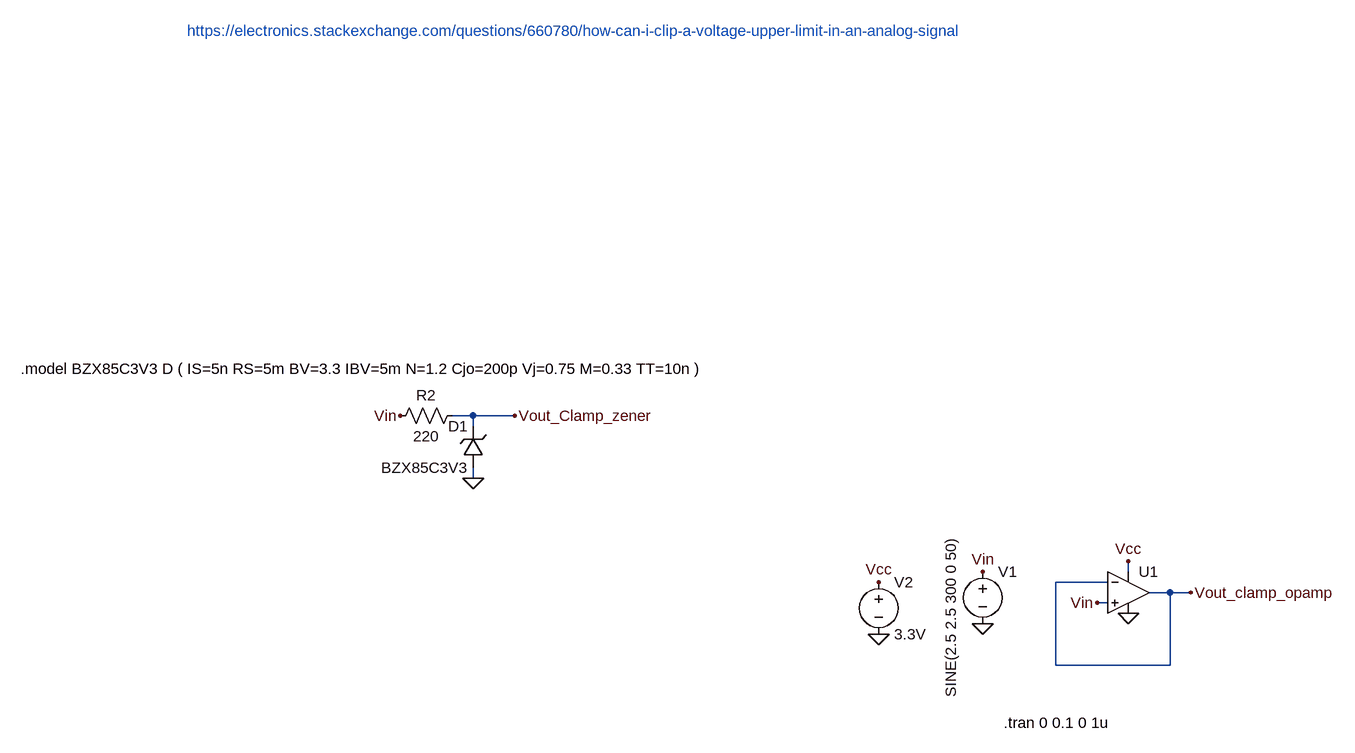
[diagram p0: schematic Voltage clamping.asc]
Voltage clamping.asc, the LTspice schematic file:
Version 4
SHEET 1 1752 720
WIRE 272 112 240 112
WIRE 336 112 272 112
WIRE 272 128 272 112
WIRE 272 208 272 192
WIRE 1280 352 1280 336
WIRE 1248 368 1168 368
WIRE 1344 384 1312 384
WIRE 1376 384 1344 384
WIRE 1248 400 1232 400
WIRE 1168 496 1168 368
WIRE 1344 496 1344 384
WIRE 1344 496 1168 496
FLAG 1056 352 Vin
FLAG 1056 432 0
FLAG 272 208 0
FLAG 160 112 Vin
FLAG 1280 416 0
FLAG 896 448 0
FLAG 1232 400 Vin
FLAG 896 368 Vcc
FLAG 1280 336 Vcc
FLAG 336 112 Vout_Clamp_zener
FLAG 1376 384 Vout_clamp_opamp
SYMBOL zener 288 192 R180
WINDOW 0 24 64 Left 2
WINDOW 3 24 0 Left 2
SYMATTR InstName D1
SYMATTR Value BZX85C3V3
SYMATTR Description Diode
SYMATTR Type diode
SYMBOL voltage 1056 336 R0
WINDOW 3 -49 -38 VRight 2
WINDOW 123 0 0 Left 0
WINDOW 39 0 0 Left 0
SYMATTR Value SINE(2.5 2.5 300 0 50)
SYMATTR InstName V1
SYMBOL res 256 96 R90
WINDOW 0 0 56 VBottom 2
WINDOW 3 32 56 VTop 2
SYMATTR InstName R2
SYMATTR Value 220
SYMBOL voltage 896 352 R0
WINDOW 123 0 0 Left 0
WINDOW 39 0 0 Left 0
SYMATTR InstName V2
SYMATTR Value 3.3V
SYMBOL OpAmps\\UniversalOpAmp2 1280 384 R0
SYMATTR InstName U1
TEXT 1088 584 Left 2 !.tran 0 0.1 0 1u
TEXT -168 -480 Left 2 ;https://electronics.stackexchange.com/questions/660780/how-can-i-clip-a-voltage-upper-limit-in-an-analog-signal
TEXT -424 40 Left 2 !.model BZX85C3V3 D ( IS=5n RS=5m BV=3.3 IBV=5m N=1.2 Cjo=200p Vj=0.75 M=0.33 TT=10n )

The netlist it stands for:
* Voltage clamping.asc
D1 0 Vout_Clamp_zener BZX85C3V3
V1 Vin 0 SINE(2.5 2.5 300 0 50)
R2 Vout_Clamp_zener Vin 220
V2 Vcc 0 3.3V
XU1 Vin Vout_clamp_opamp Vcc 0 Vout_clamp_opamp level2 Avol=1Meg GBW=10Meg Slew=10Meg Ilimit=25m Rail=0 Vos=0 En=0 Enk=0 In=0 Ink=0 Rin=500Meg  ; pins In+ In- V+ V- OUT
.model D D
.lib standard.dio
.tran 0 0.1 0 1u
* https://electronics.stackexchange.com/questions/660780/how-can-i-clip-a-voltage-upper-limit-in-an-analog-signal
.model BZX85C3V3 D ( IS=5n RS=5m BV=3.3 IBV=5m N=1.2 Cjo=200p Vj=0.75 M=0.33 TT=10n )
.lib UniversalOpAmp2.lib
.backanno
.end

* Results of the author's LTspice run, read from the files saved beside the schematic
* Operating Point, zero values left out:
*   V(vout_clamp_zener) = 2.5 V
*   V(vin) = 2.5 V
*   V(vcc) = 3.3 V
*   V(vout_clamp_opamp) = 2.5 V
*   I(D1) = -5.003 nA
*   I(R2) = -5.003 nA
*   I(V1) = -6.703 nA
*   I(V2) = -141.4 µA
*   Ix(u1:1) = 1.7 nA
*   Ix(u1:2) = 1.7 nA
*   Ix(u1:3) = 141.4 µA
*   Ix(u1:4) = -141.4 µA
*   Ix(u1:5) = -1.7 nA
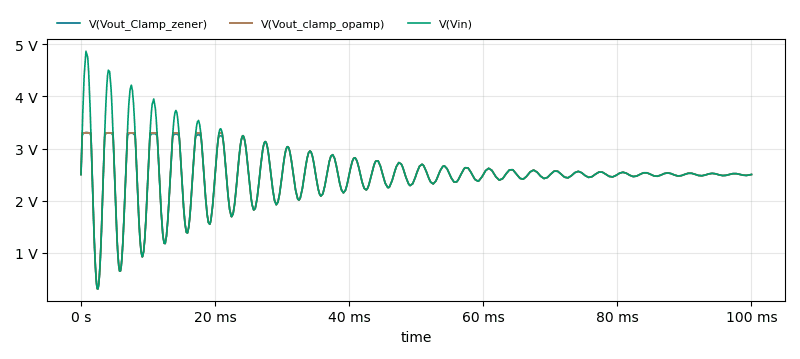
[diagram p1: Transient Analysis of Voltage clamping.asc, plotted from the saved traces]
* Transient Analysis, 1 run:
*   V(Vout_Clamp_zener): min 302.3 mV, max 3.309 V, average 2.473 V, rms 2.516 V, last 2.5 V
*   V(Vout_clamp_opamp): min 302.3 mV, max 3.3 V, average 2.475 V, rms 2.518 V, last 2.5 V
*   V(Vin): min 302.3 mV, max 4.87 V, average 2.514 V, rms 2.575 V, last 2.5 V